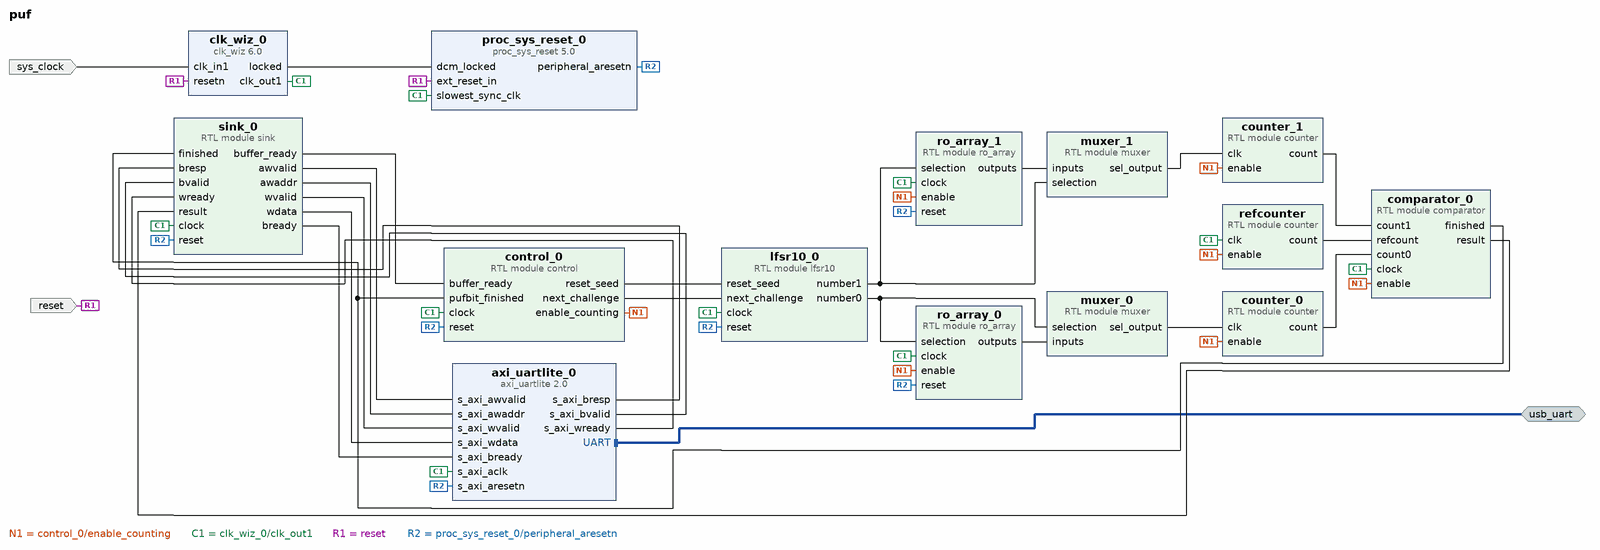
[diagram p0: block diagram of the top level]
# Vivado block design puf, xc7a100tcsg324-1, Vivado 2020.1
create_bd_design puf

create_bd_intf_port -mode Master -vlnv xilinx.com:interface:uart_rtl:1.0 usb_uart
create_bd_port -dir I -type clk sys_clock
set_property -dict {CONFIG.ASSOCIATED_RESET reset CONFIG.FREQ_HZ 100000000 CONFIG.PHASE 0.000} [get_bd_ports sys_clock]
create_bd_port -dir I -type rst reset
set_property -dict {CONFIG.POLARITY ACTIVE_LOW} [get_bd_ports reset]

create_bd_cell -type ip -vlnv xilinx.com:ip:clk_wiz:6.0 clk_wiz_0
set_property -dict [list \
  CONFIG.CLK_IN1_BOARD_INTERFACE sys_clock \
  CONFIG.RESET_BOARD_INTERFACE reset \
  CONFIG.RESET_PORT resetn \
  CONFIG.RESET_TYPE ACTIVE_LOW \
  CONFIG.USE_BOARD_FLOW true \
  CONFIG.USE_LOCKED true \
] [get_bd_cells clk_wiz_0]
create_bd_cell -type ip -vlnv xilinx.com:ip:proc_sys_reset:5.0 proc_sys_reset_0
set_property -dict {CONFIG.RESET_BOARD_INTERFACE reset CONFIG.USE_BOARD_FLOW true} [get_bd_cells proc_sys_reset_0]
create_bd_cell -type ip -vlnv xilinx.com:ip:axi_uartlite:2.0 axi_uartlite_0
set_property -dict [list \
  CONFIG.C_BAUDRATE 230400 \
  CONFIG.UARTLITE_BOARD_INTERFACE usb_uart \
  CONFIG.USE_BOARD_FLOW true \
] [get_bd_cells axi_uartlite_0]
create_bd_cell -type module -reference counter counter_0
create_bd_cell -type module -reference counter counter_1
create_bd_cell -type module -reference counter refcounter
create_bd_cell -type module -reference muxer muxer_0
set_property -dict {CONFIG.select_size 5} [get_bd_cells muxer_0]
create_bd_cell -type module -reference muxer muxer_1
set_property -dict {CONFIG.select_size 5} [get_bd_cells muxer_1]
create_bd_cell -type module -reference comparator comparator_0
create_bd_cell -type module -reference sink sink_0
create_bd_cell -type module -reference lfsr10 lfsr10_0
create_bd_cell -type module -reference control control_0
create_bd_cell -type module -reference ro_array ro_array_0
set_property -dict {CONFIG.select_size 5} [get_bd_cells ro_array_0]
create_bd_cell -type module -reference ro_array ro_array_1
set_property -dict {CONFIG.select_size 5} [get_bd_cells ro_array_1]

# ---- connections ----

connect_bd_intf_net [get_bd_intf_ports usb_uart] [get_bd_intf_pins axi_uartlite_0/UART]
connect_bd_net [get_bd_pins comparator_0/finished] [get_bd_pins sink_0/finished] [get_bd_pins control_0/pufbit_finished]
connect_bd_net [get_bd_pins muxer_0/sel_output] [get_bd_pins counter_0/clk]
connect_bd_net [get_bd_pins muxer_1/sel_output] [get_bd_pins counter_1/clk]
connect_bd_net [get_bd_pins control_0/enable_counting] \
  [get_bd_pins counter_0/enable] [get_bd_pins counter_1/enable] [get_bd_pins refcounter/enable] \
  [get_bd_pins comparator_0/enable] [get_bd_pins ro_array_0/enable] [get_bd_pins ro_array_1/enable]
connect_bd_net [get_bd_pins counter_0/count] [get_bd_pins comparator_0/count0]
connect_bd_net [get_bd_pins counter_1/count] [get_bd_pins comparator_0/count1]
connect_bd_net [get_bd_pins refcounter/count] [get_bd_pins comparator_0/refcount]
connect_bd_net -net sys_clock_1 [get_bd_pins clk_wiz_0/clk_out1] \
  [get_bd_pins proc_sys_reset_0/slowest_sync_clk] [get_bd_pins axi_uartlite_0/s_axi_aclk] [get_bd_pins refcounter/clk] \
  [get_bd_pins comparator_0/clock] [get_bd_pins sink_0/clock] [get_bd_pins lfsr10_0/clock] [get_bd_pins control_0/clock] \
  [get_bd_pins ro_array_0/clock] [get_bd_pins ro_array_1/clock]
connect_bd_net -net ro_array_0_output [get_bd_pins ro_array_0/outputs] [get_bd_pins muxer_0/inputs]
connect_bd_net [get_bd_ports sys_clock] [get_bd_pins clk_wiz_0/clk_in1]
connect_bd_net [get_bd_pins ro_array_1/outputs] [get_bd_pins muxer_1/inputs]
connect_bd_net [get_bd_ports reset] [get_bd_pins clk_wiz_0/resetn] [get_bd_pins proc_sys_reset_0/ext_reset_in]
connect_bd_net [get_bd_pins proc_sys_reset_0/peripheral_aresetn] \
  [get_bd_pins axi_uartlite_0/s_axi_aresetn] [get_bd_pins sink_0/reset] [get_bd_pins lfsr10_0/reset] \
  [get_bd_pins control_0/reset] [get_bd_pins ro_array_0/reset] [get_bd_pins ro_array_1/reset]
connect_bd_net [get_bd_pins clk_wiz_0/locked] [get_bd_pins proc_sys_reset_0/dcm_locked]
connect_bd_net [get_bd_pins lfsr10_0/number0] [get_bd_pins muxer_0/selection] [get_bd_pins ro_array_0/selection]
connect_bd_net [get_bd_pins lfsr10_0/number1] [get_bd_pins muxer_1/selection] [get_bd_pins ro_array_1/selection]
connect_bd_net [get_bd_pins sink_0/awvalid] [get_bd_pins axi_uartlite_0/s_axi_awvalid]
connect_bd_net [get_bd_pins sink_0/awaddr] [get_bd_pins axi_uartlite_0/s_axi_awaddr]
connect_bd_net [get_bd_pins sink_0/wvalid] [get_bd_pins axi_uartlite_0/s_axi_wvalid]
connect_bd_net [get_bd_pins sink_0/wdata] [get_bd_pins axi_uartlite_0/s_axi_wdata]
connect_bd_net [get_bd_pins sink_0/bready] [get_bd_pins axi_uartlite_0/s_axi_bready]
connect_bd_net [get_bd_pins axi_uartlite_0/s_axi_bresp] [get_bd_pins sink_0/bresp]
connect_bd_net [get_bd_pins axi_uartlite_0/s_axi_bvalid] [get_bd_pins sink_0/bvalid]
connect_bd_net [get_bd_pins axi_uartlite_0/s_axi_wready] [get_bd_pins sink_0/wready]
connect_bd_net [get_bd_pins comparator_0/result] [get_bd_pins sink_0/result]
connect_bd_net [get_bd_pins control_0/reset_seed] [get_bd_pins lfsr10_0/reset_seed]
connect_bd_net [get_bd_pins control_0/next_challenge] [get_bd_pins lfsr10_0/next_challenge]
connect_bd_net [get_bd_pins sink_0/buffer_ready] [get_bd_pins control_0/buffer_ready]

validate_bd_design
save_bd_design
